# Altium project JADEKU.PRJPCB
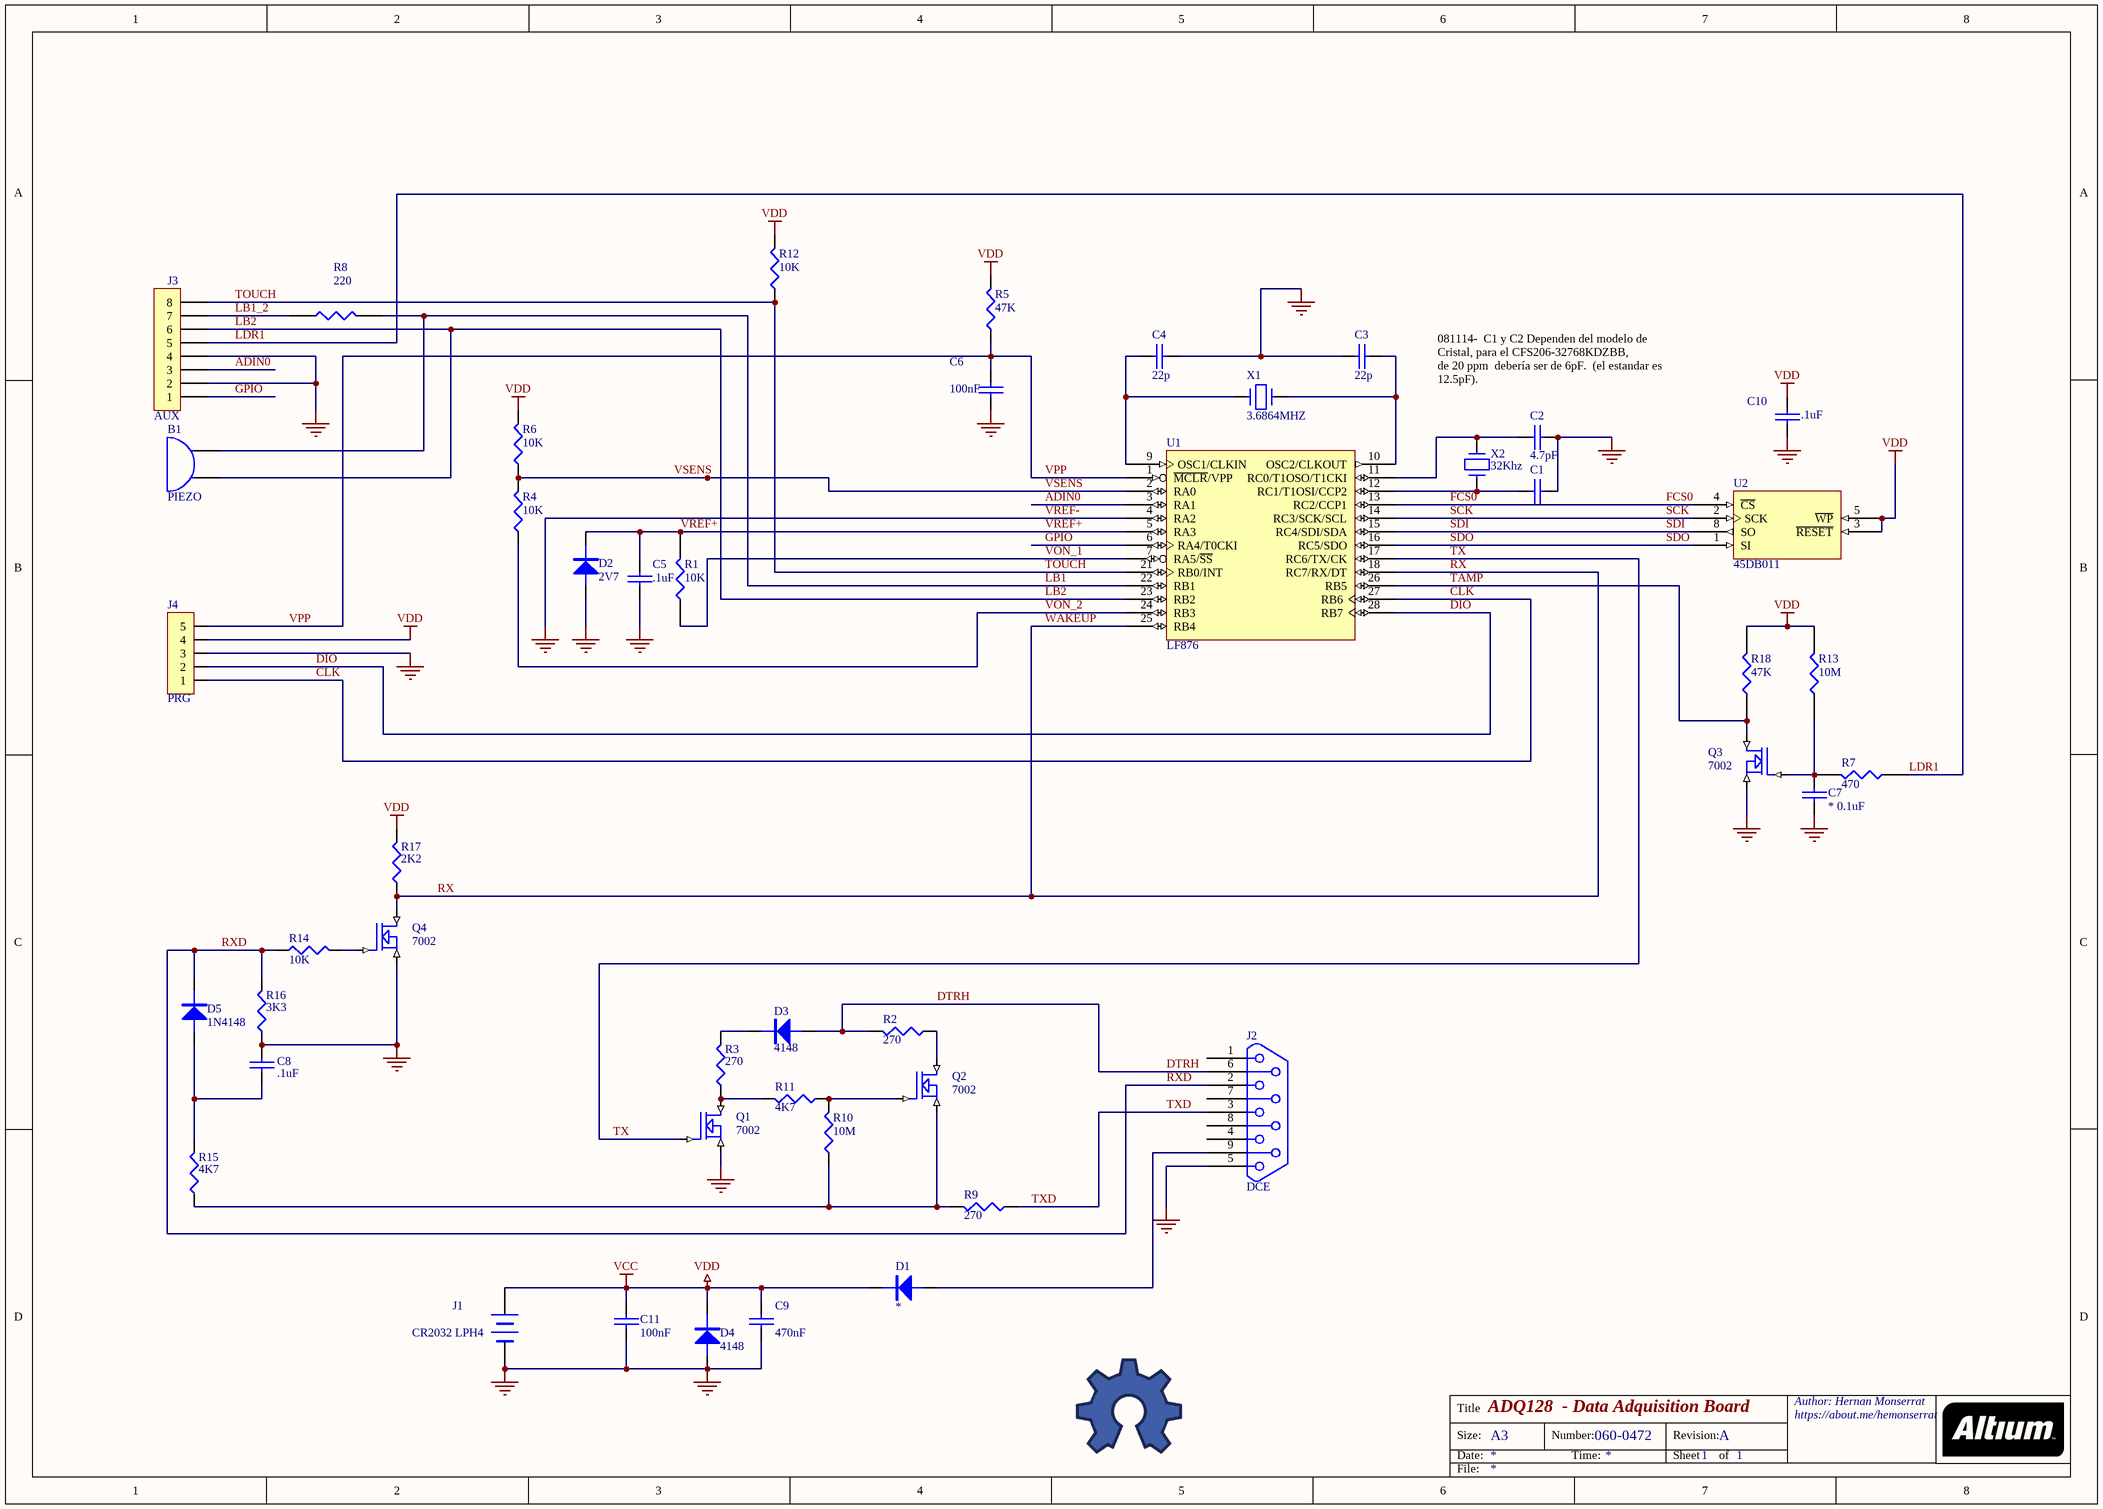
[diagram p0: 060-0472.SchDoc]
1 sheet, 47 parts. Net scope: global (net labels, ports and power ports of the same name join across sheets).
Board file: 090-0472.PcbDoc

## Sheet 060-0472.SchDoc: ADQ128  - Data Adquisition Board
size A3; Organization: Author: Hernan Monserrat; Address1: https://about.me/hemonserrat; DocumentNumber: 060-0472; Revision: A; SheetNumber: 1; SheetTotal: 1

### Parts
B1  PIEZO  [RB.3/.6]
C1  4.7pF  [1206A0805]  (value not drawn)
C2  4.7pF  [1206A0805]
C3  22p  [1206A0805]
C4  22p  [1206A0805]
C5  .1uF  [1206A0805]
C6  100nF  [1206A0805]
C7  * 0.1uF  [1206A0805]
C8  .1uF  [1206A0805]
C9  470nF  [1206A0805]
C10  .1uF  [1206A0805]
C11  100nF  [1206A0805]
D1  *  [MLL34]
D2  2V7  [MLL34]
D3  4148  [MLL34]
D4  4148  [MLL34]
D5  1N4148  [MLL34]
J1  CR2032 LPH4  [LPH4]
J2  DCE  [SDB9M]
J3  AUX  [SIP8]
J4  PRG  [SIP5]
Q1  7002  [SOT-23]
Q2  7002  [SOT-23]
Q3  7002  [SOT-23]
Q4  7002  [SOT-23]
R1  10K  [1206A0805]
R2  270  [1206A0805]
R3  270  [1206A0805]
R4  10K  [1206A0805]
R5  47K  [1206A0805]
R6  10K  [1206A0805]
R7  470  [1206A0805]
R8  220  [1206A0805]
R9  270  [1206A0805]
R10  10M  [1206A0805]
R11  4K7  [1206A0805]
R12  10K  [1206A0805]
R13  10M  [1206A0805]
R14  10K  [1206A0805]
R15  4K7  [1206A0805]
R16  3K3  [1206A0805]
R17  2K2  [1206A0805]
R18  47K  [1206A0805]
U1  LF876  [SO28W]
U2  45DB011  [SO8W]
X1  3.6864MHZ  [XTAL1]
X2  32Khz  [0805]

### Nets
VCC: C9.1 C10.1 C11.1 D1.1 D4.1 J1.1(+) J4.4 R5.2 R6.2 R12.2 R13.2 R17.2 R18.2 U1.20(VDD) U2.3(~{RESET}) U2.5(~{WP}) U2.6(VCC)  [also labelled VDD]
VREF-: C1.2 C2.2 C3.1 C4.2 C5.2 C6.2 C7.2 C8.1 C9.2 C10.2 C11.2 D2.2 D4.2 J1.2(-) J2.5 J3.2 J3.4 J4.3 Q1.2(SOURCE) Q3.2(SOURCE) Q4.2(SOURCE) R16.1 U1.4(RA2) U1.8(VSS) U1.19(VSS) U2.7(GND)  [also labelled GND, VSS]
ADIN0: J3.3 U1.3(RA1)
CLK: J4.1 U1.27(RB6)
DIO: J4.2 U1.28(RB7)
DTRH: D3.2 J2.6 R2.2
FCS0: U1.13(RC2/CCP1) U2.4(~{CS})
GPIO: J3.1 U1.6(RA4/T0CKI)
LB1: B1.2(B) R8.2 U1.22(RB1)
LB1_2: J3.7 R8.1
LB2: B1.1(A) J3.6 U1.23(RB2)
LDR1: J3.5 R7.1
RX: Q4.3(DRAIN) R17.1 U1.18(RC7/RX/DT) U1.25(RB4)  [also labelled WAKEUP]
RXD: D5.1 J2.2 R14.1 R16.2
SCK: U1.14(RC3/SCK/SCL) U2.2(SCK)
SDI: U1.15(RC4/SDI/SDA) U2.8(SO)
SDO: U1.16(RC5/SDO) U2.1(SI)
TAMP: Q3.3(DRAIN) R18.1 U1.26(RB5)
TOUCH: J3.8 R12.1 U1.21(RB0/INT)
TX: Q1.1(GATE) U1.17(RC6/TX/CK)
TXD: J2.3 R9.1
VON_1: R1.1 U1.7(RA5/~{SS})
VON_2: R4.1 U1.24(RB3)
VPP: C6.1 J4.5 R5.1 U1.1(~{MCLR}/VPP)
VREF+: C5.1 D2.1 R1.2 U1.5(RA3)
VSENS: R4.2 R6.1 U1.2(RA0)
NetC1_1: C1.1 U1.12(RC1/T1OSI/CCP2) X2.1
NetC2_1: C2.1 U1.11(RC0/T1OSO/T1CKI) X2.2
NetC3_2: C3.2 U1.10(OSC2/CLKOUT) X1.2
NetC4_1: C4.1 U1.9(OSC1/CLKIN) X1.1
NetC7_1: C7.1 Q3.1(GATE) R7.2 R13.1
NetC8_2: C8.2 D5.2 R15.2
NetD1_2: D1.2 J2.9
NetD3_1: D3.1 R3.2
NetQ1_3: Q1.3(DRAIN) R3.1 R11.2
NetQ2_1: Q2.1(GATE) R10.2 R11.1
NetQ2_2: Q2.2(SOURCE) R9.2 R10.1 R15.1
NetQ2_3: Q2.3(DRAIN) R2.1
NetQ4_1: Q4.1(GATE) R14.2

Not connected (* = marked no-connect by the designer): J2 1 4 7 8

### Notes on the sheet
- 081114-  C1 y C2 Dependen del modelo de Cristal, para el CFS206-32768KDZBB,
  de 20 ppm  debería ser de 6pF.  (el estandar es 12.5pF).
- Title
- Size:
- Date:
- A3
- Number:
- Time:
- Revision:
- Sheet
- of
- File:

### Library data of the parts
B1 = BUZZER
C1-C4 C6 C8 C9 C11 = CAP
C5 C7 C10 = CAP: Capacitor
D1-D5 = DIODE-12
J1 = BATTERY
J2 = DB9
J3 = CON8: Connector
J4 = CON5
Q1-Q4 = NMOS-213: MOSFET SGD=213
R1-R18 = RES1
U1 = PIC16C63-04/JW(28): 8-Bit CMOS Microcontrollers
U2 = AT45DB011: Serial Data Flash
X1 X2 = CRYSTAL